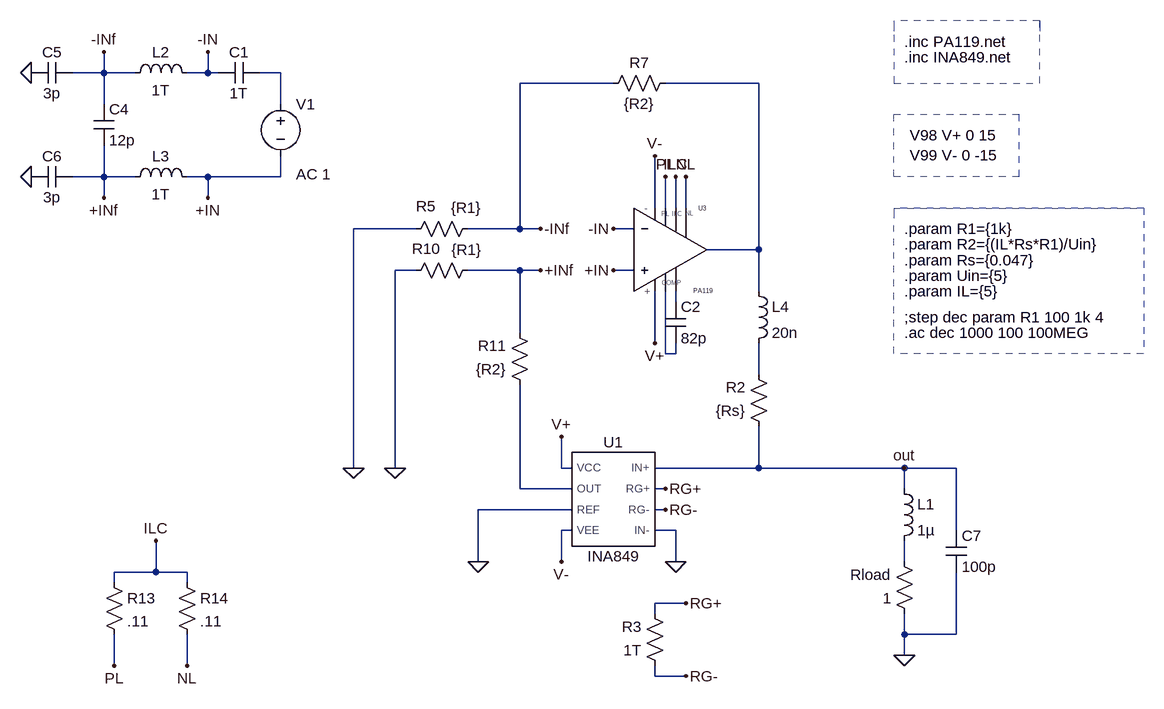
[diagram p0: schematic Howland_current_2_OL.asc]
Howland_current_2_OL.asc, the LTspice schematic file:
Version 4
SHEET 1 1196 2988
WIRE -1408 1936 -1408 1904
WIRE -1408 1936 -1456 1936
WIRE -1360 1936 -1408 1936
WIRE -1248 1936 -1248 1904
WIRE -1248 1936 -1280 1936
WIRE -1232 1936 -1248 1936
WIRE -1136 1936 -1168 1936
WIRE -624 1952 -768 1952
WIRE -400 1952 -544 1952
WIRE -1408 1984 -1408 1936
WIRE -1136 1984 -1136 1936
WIRE -1408 2096 -1408 2048
WIRE -1408 2096 -1456 2096
WIRE -1360 2096 -1408 2096
WIRE -1248 2096 -1280 2096
WIRE -1136 2096 -1136 2064
WIRE -1136 2096 -1248 2096
WIRE -1408 2128 -1408 2096
WIRE -1248 2128 -1248 2096
WIRE -560 2144 -560 2064
WIRE -544 2144 -544 2096
WIRE -528 2144 -528 2096
WIRE -512 2144 -512 2096
WIRE -928 2176 -1024 2176
WIRE -768 2176 -768 1952
WIRE -768 2176 -848 2176
WIRE -736 2176 -768 2176
WIRE -592 2176 -624 2176
WIRE -400 2208 -400 1952
WIRE -400 2208 -480 2208
WIRE -928 2240 -960 2240
WIRE -768 2240 -848 2240
WIRE -736 2240 -768 2240
WIRE -592 2240 -624 2240
WIRE -400 2272 -400 2208
WIRE -528 2288 -528 2272
WIRE -768 2336 -768 2240
WIRE -560 2352 -560 2272
WIRE -544 2368 -544 2272
WIRE -528 2368 -528 2352
WIRE -528 2368 -544 2368
WIRE -400 2400 -400 2352
WIRE -1024 2544 -1024 2176
WIRE -960 2544 -960 2240
WIRE -704 2544 -704 2496
WIRE -688 2544 -704 2544
WIRE -400 2544 -400 2480
WIRE -400 2544 -560 2544
WIRE -176 2544 -400 2544
WIRE -96 2544 -176 2544
WIRE -768 2576 -768 2416
WIRE -688 2576 -768 2576
WIRE -544 2576 -560 2576
WIRE -176 2576 -176 2544
WIRE -688 2608 -832 2608
WIRE -544 2608 -560 2608
WIRE -688 2640 -704 2640
WIRE -528 2640 -560 2640
WIRE -96 2640 -96 2544
WIRE -832 2688 -832 2608
WIRE -704 2688 -704 2640
WIRE -528 2688 -528 2640
WIRE -176 2688 -176 2656
WIRE -1328 2704 -1328 2656
WIRE -1328 2704 -1392 2704
WIRE -1280 2704 -1328 2704
WIRE -1392 2720 -1392 2704
WIRE -1280 2720 -1280 2704
WIRE -512 2752 -560 2752
WIRE -560 2768 -560 2752
WIRE -176 2800 -176 2768
WIRE -96 2800 -96 2704
WIRE -96 2800 -176 2800
WIRE -176 2832 -176 2800
WIRE -1392 2848 -1392 2800
WIRE -1280 2848 -1280 2800
WIRE -560 2864 -560 2848
WIRE -512 2864 -560 2864
FLAG -560 2352 V+
FLAG -560 2064 V-
FLAG -960 2544 0
FLAG -1024 2544 0
FLAG -544 2096 PL
FLAG -528 2096 ILC
FLAG -512 2096 NL
FLAG -1392 2848 PL
FLAG -1328 2656 ILC
FLAG -1280 2848 NL
FLAG -624 2176 -IN
FLAG -624 2240 +IN
FLAG -736 2176 -INf
FLAG -736 2240 +INf
FLAG -1520 1936 0
FLAG -1520 2096 0
FLAG -1408 1904 -INf
FLAG -1408 2128 +INf
FLAG -1248 1904 -IN
FLAG -1248 2128 +IN
FLAG -176 2832 0
FLAG -704 2496 V+
FLAG -704 2688 V-
FLAG -832 2688 0
FLAG -512 2752 RG+
FLAG -512 2864 RG-
FLAG -544 2576 RG+
FLAG -544 2608 RG-
FLAG -528 2688 0
FLAG -176 2544 out
SYMBOL res -832 2160 R90
WINDOW 0 -3 80 VBottom 2
WINDOW 3 -32 18 VTop 2
SYMATTR InstName R5
SYMATTR Value {R1}
SYMBOL res -528 1936 R90
WINDOW 0 0 56 VBottom 2
WINDOW 3 32 56 VTop 2
SYMATTR InstName R7
SYMATTR Value {R2}
SYMBOL res -832 2224 R90
WINDOW 0 -2 80 VBottom 2
WINDOW 3 -31 17 VTop 2
SYMATTR InstName R10
SYMATTR Value {R1}
SYMBOL res -752 2432 R180
WINDOW 0 36 76 Left 2
WINDOW 3 36 40 Left 2
SYMATTR InstName R11
SYMATTR Value {R2}
SYMBOL cap -544 2352 M180
WINDOW 0 24 56 Left 2
WINDOW 3 24 8 Left 2
SYMATTR InstName C2
SYMATTR Value 82p
SYMBOL res -1408 2704 R0
SYMATTR InstName R13
SYMATTR Value .11
SYMBOL res -1296 2704 R0
SYMATTR InstName R14
SYMATTR Value .11
SYMBOL PA119 -512 2224 M180
SYMATTR InstName U3
SYMBOL voltage -1136 1968 R0
WINDOW 3 24 152 Left 2
WINDOW 123 24 124 Left 2
WINDOW 39 0 0 Left 0
SYMATTR Value ""
SYMATTR Value2 AC 1
SYMATTR InstName V1
SYMBOL cap -1168 1920 R90
WINDOW 0 0 32 VBottom 2
WINDOW 3 32 32 VTop 2
SYMATTR InstName C1
SYMATTR Value 1T
SYMBOL ind -1376 1952 R270
WINDOW 0 32 56 VTop 2
WINDOW 3 5 56 VBottom 2
SYMATTR InstName L2
SYMATTR Value 1T
SYMBOL ind -1376 2112 R270
WINDOW 0 32 56 VTop 2
WINDOW 3 5 56 VBottom 2
SYMATTR InstName L3
SYMATTR Value 1T
SYMBOL cap -1424 1984 R0
SYMATTR InstName C4
SYMATTR Value 12p
SYMBOL cap -1456 1920 R90
WINDOW 0 0 32 VBottom 2
WINDOW 3 32 32 VTop 2
SYMATTR InstName C5
SYMATTR Value 3p
SYMBOL cap -1456 2080 R90
WINDOW 0 0 32 VBottom 2
WINDOW 3 32 32 VTop 2
SYMATTR InstName C6
SYMATTR Value 3p
SYMBOL res -384 2496 R180
WINDOW 0 36 76 Left 2
WINDOW 3 36 40 Left 2
SYMATTR InstName R2
SYMATTR Value {Rs}
SYMBOL res -160 2784 R180
WINDOW 0 36 76 Left 2
WINDOW 3 36 40 Left 2
SYMATTR InstName Rload
SYMATTR Value 1
SYMBOL INA849 -624 2592 M0
SYMATTR InstName U1
SYMBOL res -544 2864 R180
WINDOW 0 36 76 Left 2
WINDOW 3 36 40 Left 2
SYMATTR InstName R3
SYMATTR Value 1T
SYMBOL ind -192 2560 R0
SYMATTR InstName L1
SYMATTR Value 1µ
SYMBOL cap -112 2640 R0
SYMATTR InstName C7
SYMATTR Value 100p
SYMBOL ind -416 2256 R0
SYMATTR InstName L4
SYMATTR Value 20n
TEXT -176 2336 Left 2 !.ac dec 1000 100 100MEG
TEXT -168 2032 Left 2 !V98 V+ 0 15\nV99 V- 0 -15
TEXT -176 1912 Left 2 !.inc INA849.net
TEXT -176 1888 Left 2 !.inc PA119.net
TEXT -176 2176 Left 2 !.param R1={1k}
TEXT -176 2200 Left 2 !.param R2={(IL*Rs*R1)/Uin}
TEXT -176 2312 Left 2 !;step dec param R1 100 1k 4
TEXT -176 2224 Left 2 !.param Rs={0.047}
TEXT -176 2248 Left 2 !.param Uin={5}
TEXT -176 2272 Left 2 !.param IL={5}
LINE Normal 32 1856 -192 1856 3
LINE Normal 32 1952 32 1856 3
LINE Normal -192 1952 32 1952 3
LINE Normal -192 1856 -192 1952 3
LINE Normal -192 1856 -192 1872 3
LINE Normal 32 1856 32 1872 3
LINE Normal -192 2096 -192 2000 3
LINE Normal 0 2096 -192 2096 3
LINE Normal 0 2000 0 2096 3
LINE Normal -192 2000 0 2000 3
LINE Normal -192 2144 -192 2160 3
LINE Normal 192 2144 -192 2144 3
LINE Normal -192 2368 -192 2160 4
LINE Normal 192 2368 -192 2368 4
LINE Normal 192 2144 192 2368 4
LINE Normal -192 2144 192 2144 4

The netlist it stands for:
* Howland_current_2_OL.asc
R5 -INf 0 {R1}
R7 N002 -INf {R2}
R10 +INf 0 {R1}
R11 N006 +INf {R2}
C2 N004 N003 82p
R13 ILC PL .11
R14 ILC NL .11
XU3 +IN -IN N002 V+ V- N004 N003 PL ILC NL PA119  ; pins +IN -IN OUT +V -V COMP COMP PL ILC NL
V1 N001 +IN AC 1
C1 N001 -IN 1T
L2 -INf -IN 1T
L3 +INf +IN 1T
C4 -INf +INf 12p
C5 -INf 0 3p
C6 +INf 0 3p
R2 out N005 {Rs}
Rload 0 N007 1
XU1 out 0 V+ V- N006 0 RG+ RG- INA849  ; pins IN+ IN- VCC VEE OUT REF RG+ RG-
R3 RG- RG+ 1T
L1 out N007 1µ
C7 out 0 100p
L4 N002 N005 20n
.ac dec 1000 100 100MEG
V98 V+ 0 15
V99 V- 0 -15
.inc INA849.net
.inc PA119.net
.param R1={1k}
.param R2={(IL*Rs*R1)/Uin}
;step dec param R1 100 1k 4
.param Rs={0.047}
.param Uin={5}
.param IL={5}
.lib .\INA849.net
.backanno
.end